# Altium schematic sheet 06- MCU PORTA_B.SchDoc: MCU2
size 420 x 297 mm; Revision: 1.0; SheetNumber: 6; SheetTotal: 13; Project: LOW LEVEL ECU
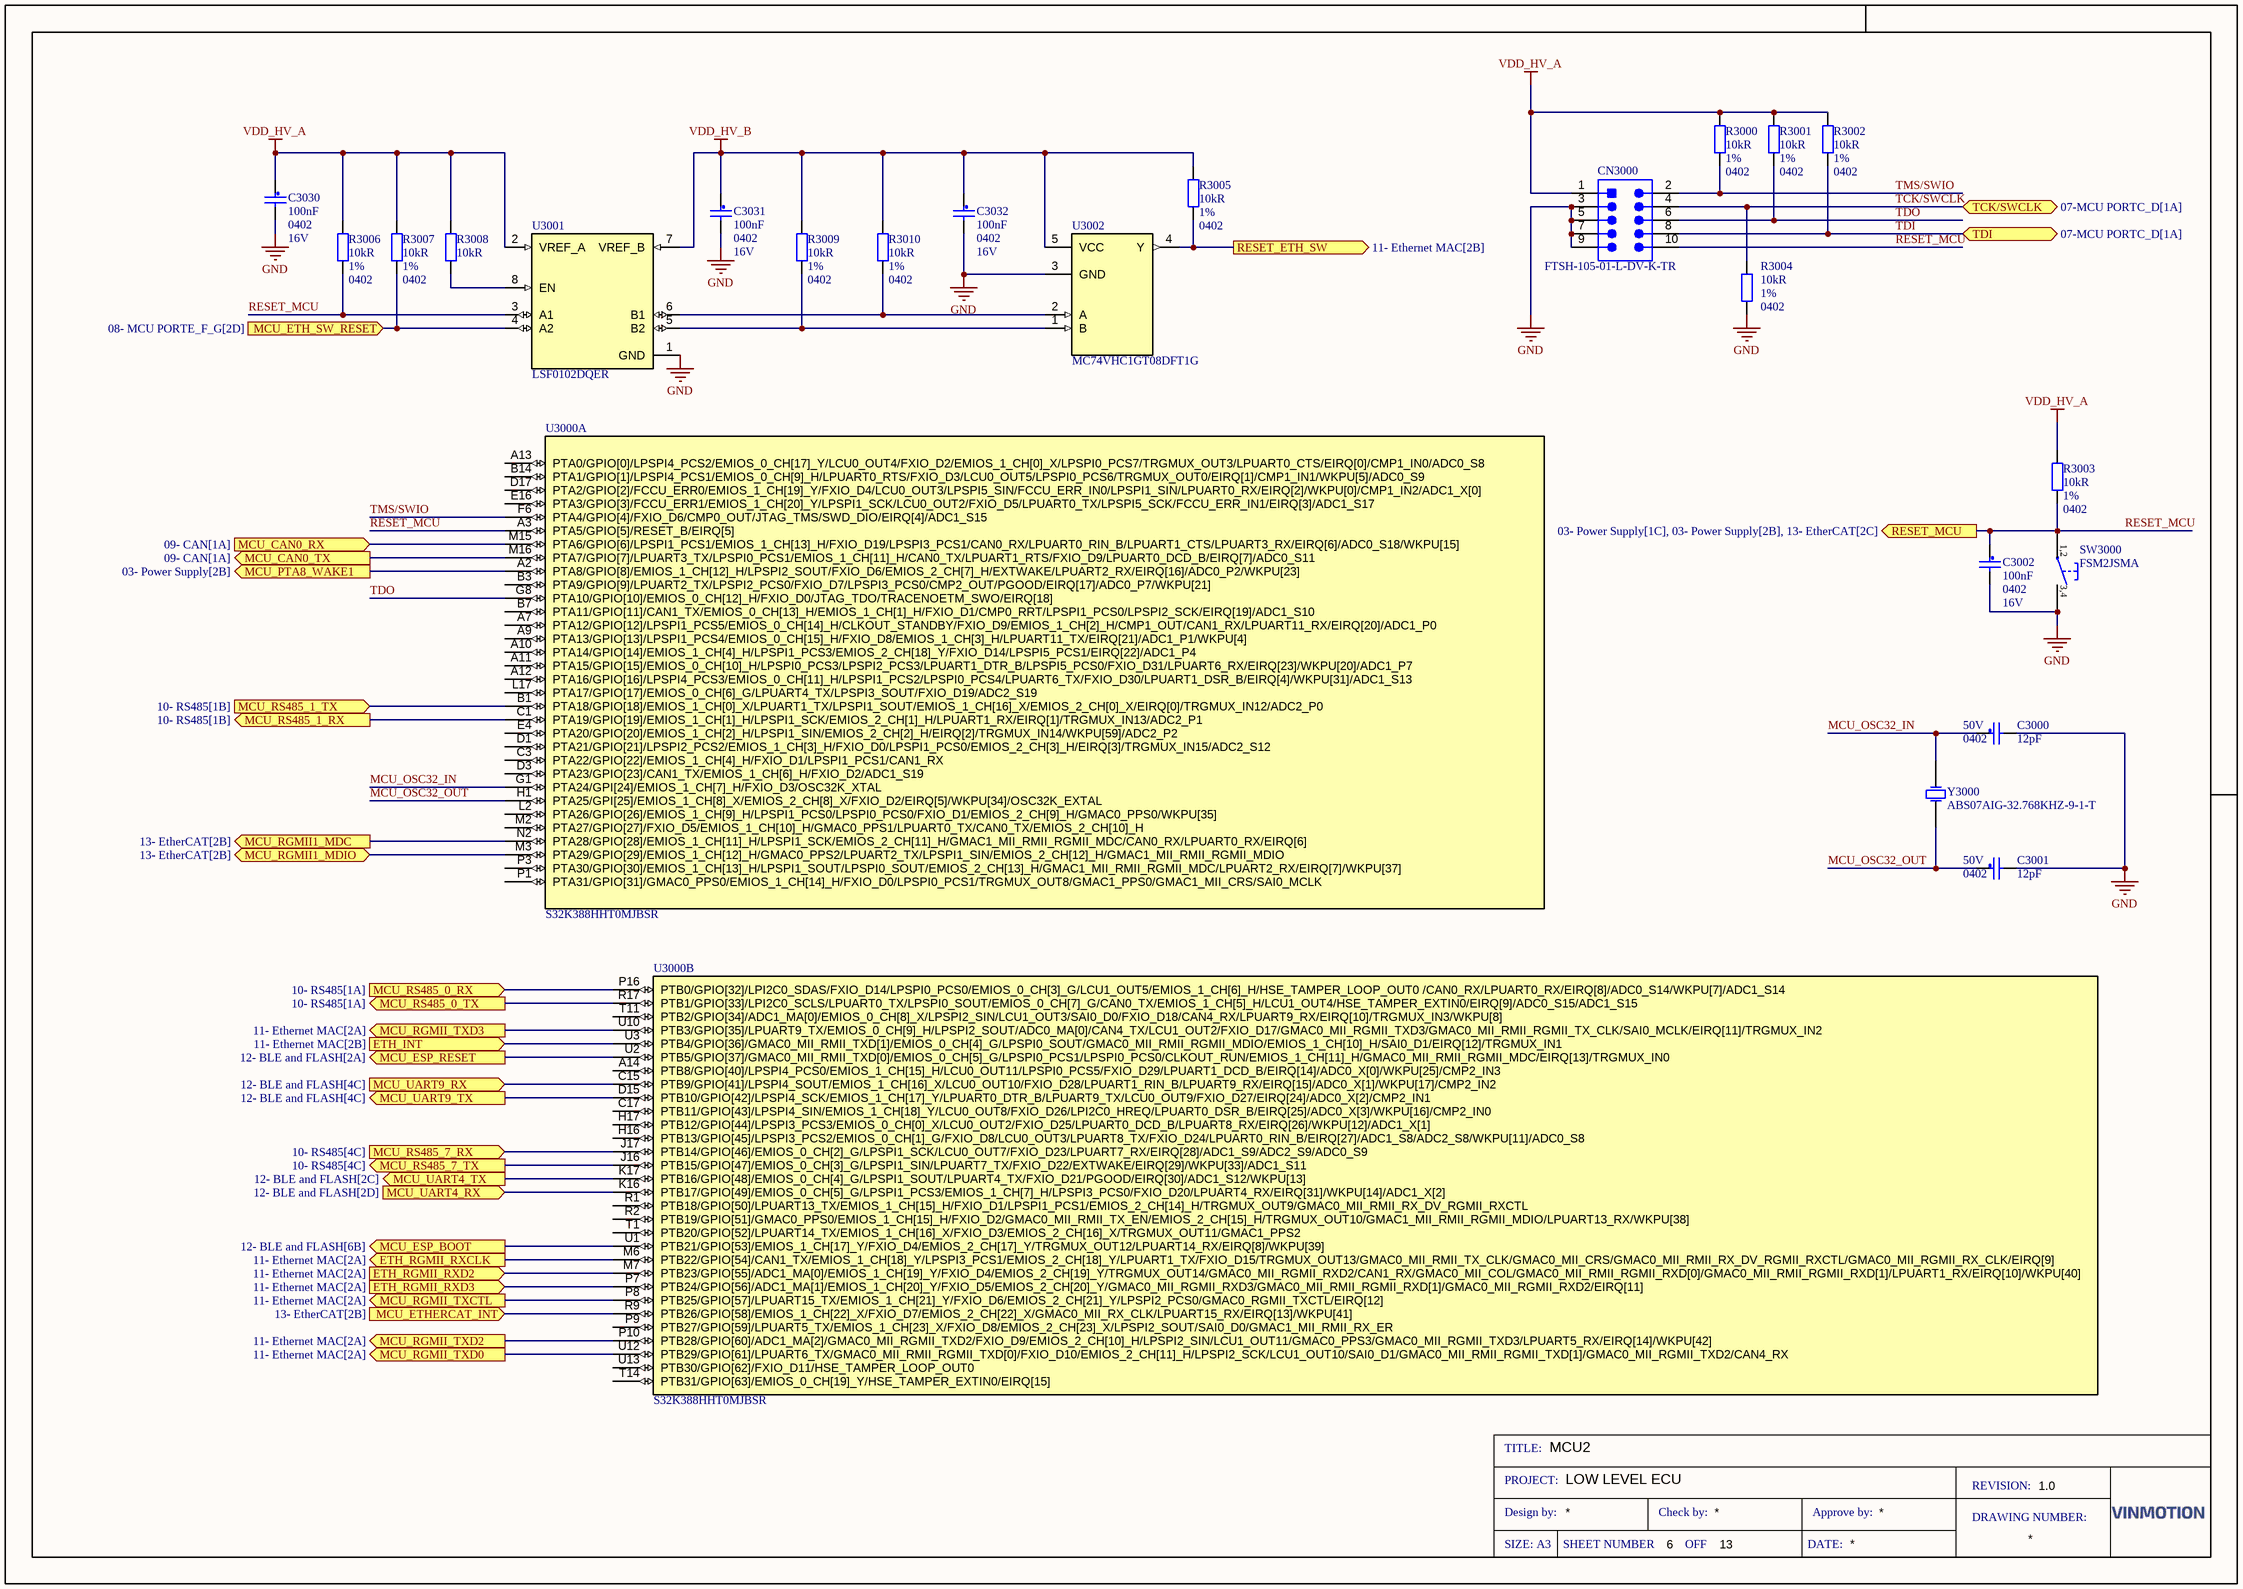
[diagram p0: 06- MCU PORTA_B.SchDoc]

## Parts
C3000  Voltage Rating: 50V  Case/Package: 0402  Capacitance: 12pF  [CAP0402]  (hidden comment: GCM1555C1H120JA16D)
C3001  Voltage Rating: 50V  Case/Package: 0402  Capacitance: 12pF  [CAP0402]  (hidden comment: GCM1555C1H120JA16D)
C3002  Capacitance: 100nF  Case/Package: 0402  Voltage Rating (DC): 16V  [CAP0402]  (hidden comment: 0402YC104KAT2A)
C3030  Capacitance: 100nF  Case/Package: 0402  Voltage Rating (DC): 16V  [CAP0402]  (hidden comment: 0402YC104KAT2A)
C3031  Capacitance: 100nF  Case/Package: 0402  Voltage Rating (DC): 16V  [CAP0402]  (hidden comment: 0402YC104KAT2A)
C3032  Capacitance: 100nF  Case/Package: 0402  Voltage Rating (DC): 16V  [CAP0402]  (hidden comment: 0402YC104KAT2A)
CN3000  FTSH-105-01-L-DV-K-TR  [SMTC-FTSH-105-01-L-DV-K_R]
R3000  value 10kR  Tolerance: 1%  Case/Package: 0402  [RES0402]  (hidden comment: RMCF0402FT10K0)
R3001  value 10kR  Tolerance: 1%  Case/Package: 0402  [RES0402]  (hidden comment: RMCF0402FT10K0)
R3002  value 10kR  Tolerance: 1%  Case/Package: 0402  [RES0402]  (hidden comment: RMCF0402FT10K0)
R3003  value 10kR  Tolerance: 1%  Case/Package: 0402  [RES0402]  (hidden comment: RMCF0402FT10K0)
R3004  value 10kR  Tolerance: 1%  Case/Package: 0402  [RES0402]  (hidden comment: RMCF0402FT10K0)
R3005  value 10kR  Tolerance: 1%  Case/Package: 0402  [RES0402]  (hidden comment: RMCF0402FT10K0)
R3006  value 10kR  Tolerance: 1%  Case/Package: 0402  [RES0402]  (hidden comment: RMCF0402FT10K0)
R3007  value 10kR  Tolerance: 1%  Case/Package: 0402  [RES0402]  (hidden comment: RMCF0402FT10K0)
R3008  value 10kR  [RES0402]  (hidden comment: RMCF0402FT10K0)
R3009  value 10kR  Tolerance: 1%  Case/Package: 0402  [RES0402]  (hidden comment: RMCF0402FT10K0)
R3010  value 10kR  Tolerance: 1%  Case/Package: 0402  [RES0402]  (hidden comment: RMCF0402FT10K0)
SW3000  FSM2JSMA  [TE_FSM2JSMASTR_R]
U3000  S32K388HHT0MJBSR  [BGA289C80P17X17_1400X1400X152]  (parts A,B of 9)
U3001  LSF0102DQER  [8-XFDFN]
U3002  MC74VHC1GT08DFT1G  [SOT95P280X145-5N]
Y3000  ABS07AIG-32.768KHZ-9-1-T  [CRYSTAL3215]

## Ports
ETH_INT (in, see 11- Ethernet MAC[2B]), ETH_RGMII_RXCLK (out, see 11- Ethernet MAC[2A]), ETH_RGMII_RXD2 (in, see 11- Ethernet MAC[2A]), ETH_RGMII_RXD3 (in, see 11- Ethernet MAC[2A]), MCU_CAN0_RX (in, see 09- CAN[1A]), MCU_CAN0_TX (out, see 09- CAN[1A]), MCU_ESP_BOOT (out, see 12- BLE and FLASH[6B]), MCU_ESP_RESET (out, see 12- BLE and FLASH[2A]), MCU_ETH_SW_RESET (in, see 08- MCU PORTE_F_G[2D]), MCU_ETHERCAT_INT (in, see 13- EtherCAT[2B]), MCU_PTA8_WAKE1 (out, see 03- Power Supply[2B]), MCU_RGMII1_MDC (out, see 13- EtherCAT[2B]), MCU_RGMII1_MDIO (bidir, see 13- EtherCAT[2B]), MCU_RGMII_TXCTL (out, see 11- Ethernet MAC[2A]), MCU_RGMII_TXD0 (out, see 11- Ethernet MAC[2A]), MCU_RGMII_TXD2 (out, see 11- Ethernet MAC[2A]), MCU_RGMII_TXD3 (out, see 11- Ethernet MAC[2A]), MCU_RS485_0_RX (in, see 10- RS485[1A]), MCU_RS485_0_TX (out, see 10- RS485[1A]), MCU_RS485_1_RX (out, see 10- RS485[1B]), MCU_RS485_1_TX (in, see 10- RS485[1B]), MCU_RS485_7_RX (in, see 10- RS485[4C]), MCU_RS485_7_TX (out, see 10- RS485[4C]), MCU_UART4_RX (in, see 12- BLE and FLASH[2D]), MCU_UART4_TX (out, see 12- BLE and FLASH[2C]), MCU_UART9_RX (in, see 12- BLE and FLASH[4C]), MCU_UART9_TX (out, see 12- BLE and FLASH[4C]), RESET_ETH_SW (out, see 11- Ethernet MAC[2B]), RESET_MCU (out, see 03- Power Supply[1C], 03- Power Supply[2B], 13- EtherCAT[2C]), TCK/SWCLK (bidir, see 07-MCU PORTC_D[1A]), TDI (bidir, see 07-MCU PORTC_D[1A])

## Nets
GND: C3000.2 C3001.2 C3002.2 C3030.2 C3031.2 C3032.2 CN3000.3 CN3000.5 CN3000.7 CN3000.9 R3004.1 SW3000.3 SW3000.4 U3001.1(GND) U3002.3(GND)
VDD_HV_A: C3030.1 CN3000.1 R3000.2 R3001.2 R3002.2 R3003.2 R3006.2 R3007.2 R3008.2 U3001.2(VREF_A)
VDD_HV_B: C3031.1 C3032.1 R3005.2 R3009.2 R3010.2 U3001.7(VREF_B) U3002.5(VCC)
ETH_INT: U3000.U3(PTB4/GPIO[36]/GMAC0_MII_RMII_TXD[1]/EMIOS_0_CH[4]_G/LPSPI0_SOUT/GMAC0_MII_RMII_RGMII_MDIO/EMIOS_1_CH[10]_H/SAI0_D1/EIRQ[12]/TRGMUX_IN1) ; port ETH_INT
ETH_RGMII_RXCLK: U3000.M6(PTB22/GPIO[54]/CAN1_TX/EMIOS_1_CH[18]_Y/LPSPI3_PCS1/EMIOS_2_CH[18]_Y/LPUART1_TX/FXIO_D15/TRGMUX_OUT13/GMAC0_MII_RMII_TX_CLK/GMAC0_MII_CRS/GMAC0_MII_RMII_RX_DV_RGMII_RXCTL/GMAC0_MII_RGMII_RX_CLK/EIRQ[9]) ; port ETH_RGMII_RXCLK
ETH_RGMII_RXD2: U3000.M7(PTB23/GPIO[55]/ADC1_MA[0]/EMIOS_1_CH[19]_Y/FXIO_D4/EMIOS_2_CH[19]_Y/TRGMUX_OUT14/GMAC0_MII_RGMII_RXD2/CAN1_RX/GMAC0_MII_COL/GMAC0_MII_RMII_RGMII_RXD[0]/GMAC0_MII_RMII_RGMII_RXD[1]/LPUART1_RX/EIRQ[10]/WKPU[40]) ; port ETH_RGMII_RXD2
ETH_RGMII_RXD3: U3000.P7(PTB24/GPIO[56]/ADC1_MA[1]/EMIOS_1_CH[20]_Y/FXIO_D5/EMIOS_2_CH[20]_Y/GMAC0_MII_RGMII_RXD3/GMAC0_MII_RMII_RGMII_RXD[1]/GMAC0_MII_RGMII_RXD2/EIRQ[11]) ; port ETH_RGMII_RXD3
MCU_CAN0_RX: U3000.M15(PTA6/GPIO[6]/LPSPI1_PCS1/EMIOS_1_CH[13]_H/FXIO_D19/LPSPI3_PCS1/CAN0_RX/LPUART0_RIN_B/LPUART1_CTS/LPUART3_RX/EIRQ[6]/ADC0_S18/WKPU[15]) ; port MCU_CAN0_RX
MCU_CAN0_TX: U3000.M16(PTA7/GPIO[7]/LPUART3_TX/LPSPI0_PCS1/EMIOS_1_CH[11]_H/CAN0_TX/LPUART1_RTS/FXIO_D9/LPUART0_DCD_B/EIRQ[7]/ADC0_S11) ; port MCU_CAN0_TX
MCU_ESP_BOOT: U3000.U1(PTB21/GPIO[53]/EMIOS_1_CH[17]_Y/FXIO_D4/EMIOS_2_CH[17]_Y/TRGMUX_OUT12/LPUART14_RX/EIRQ[8]/WKPU[39]) ; port MCU_ESP_BOOT
MCU_ESP_RESET: U3000.U2(PTB5/GPIO[37]/GMAC0_MII_RMII_TXD[0]/EMIOS_0_CH[5]_G/LPSPI0_PCS1/LPSPI0_PCS0/CLKOUT_RUN/EMIOS_1_CH[11]_H/GMAC0_MII_RMII_RGMII_MDC/EIRQ[13]/TRGMUX_IN0) ; port MCU_ESP_RESET
MCU_ETH_SW_RESET: R3007.1 U3001.4(A2) ; port MCU_ETH_SW_RESET
MCU_ETHERCAT_INT: U3000.R9(PTB26/GPIO[58]/EMIOS_1_CH[22]_X/FXIO_D7/EMIOS_2_CH[22]_X/GMAC0_MII_RX_CLK/LPUART15_RX/EIRQ[13]/WKPU[41]) ; port MCU_ETHERCAT_INT
MCU_OSC32_IN: C3000.1 U3000.G1(PTA24/GPI[24]/EMIOS_1_CH[7]_H/FXIO_D3/OSC32K_XTAL) Y3000.2(OSC2)
MCU_OSC32_OUT: C3001.1 U3000.H1(PTA25/GPI[25]/EMIOS_1_CH[8]_X/EMIOS_2_CH[8]_X/FXIO_D2/EIRQ[5]/WKPU[34]/OSC32K_EXTAL) Y3000.1(OSC1)
MCU_PTA8_WAKE1: U3000.A2(PTA8/GPIO[8]/EMIOS_1_CH[12]_H/LPSPI2_SOUT/FXIO_D6/EMIOS_2_CH[7]_H/EXTWAKE/LPUART2_RX/EIRQ[16]/ADC0_P2/WKPU[23]) ; port MCU_PTA8_WAKE1
MCU_RGMII1_MDC: U3000.N2(PTA28/GPIO[28]/EMIOS_1_CH[11]_H/LPSPI1_SCK/EMIOS_2_CH[11]_H/GMAC1_MII_RMII_RGMII_MDC/CAN0_RX/LPUART0_RX/EIRQ[6]) ; port MCU_RGMII1_MDC
MCU_RGMII1_MDIO: U3000.M3(PTA29/GPIO[29]/EMIOS_1_CH[12]_H/GMAC0_PPS2/LPUART2_TX/LPSPI1_SIN/EMIOS_2_CH[12]_H/GMAC1_MII_RMII_RGMII_MDIO) ; port MCU_RGMII1_MDIO
MCU_RGMII_TXCTL: U3000.P8(PTB25/GPIO[57]/LPUART15_TX/EMIOS_1_CH[21]_Y/FXIO_D6/EMIOS_2_CH[21]_Y/LPSPI2_PCS0/GMAC0_RGMII_TXCTL/EIRQ[12]) ; port MCU_RGMII_TXCTL
MCU_RGMII_TXD0: U3000.U12(PTB29/GPIO[61]/LPUART6_TX/GMAC0_MII_RMII_RGMII_TXD[0]/FXIO_D10/EMIOS_2_CH[11]_H/LPSPI2_SCK/LCU1_OUT10/SAI0_D1/GMAC0_MII_RMII_RGMII_TXD[1]/GMAC0_MII_RGMII_TXD2/CAN4_RX) ; port MCU_RGMII_TXD0
MCU_RGMII_TXD2: U3000.P10(PTB28/GPIO[60]/ADC1_MA[2]/GMAC0_MII_RGMII_TXD2/FXIO_D9/EMIOS_2_CH[10]_H/LPSPI2_SIN/LCU1_OUT11/GMAC0_PPS3/GMAC0_MII_RGMII_TXD3/LPUART5_RX/EIRQ[14]/WKPU[42]) ; port MCU_RGMII_TXD2
MCU_RGMII_TXD3: U3000.U10(PTB3/GPIO[35]/LPUART9_TX/EMIOS_0_CH[9]_H/LPSPI2_SOUT/ADC0_MA[0]/CAN4_TX/LCU1_OUT2/FXIO_D17/GMAC0_MII_RGMII_TXD3/GMAC0_MII_RMII_RGMII_TX_CLK/SAI0_MCLK/EIRQ[11]/TRGMUX_IN2) ; port MCU_RGMII_TXD3
MCU_RS485_0_RX: U3000.P16(PTB0/GPIO[32]/LPI2C0_SDAS/FXIO_D14/LPSPI0_PCS0/EMIOS_0_CH[3]_G/LCU1_OUT5/EMIOS_1_CH[6]_H/HSE_TAMPER_LOOP_OUT0_/CAN0_RX/LPUART0_RX/EIRQ[8]/ADC0_S14/WKPU[7]/ADC1_S14) ; port MCU_RS485_0_RX
MCU_RS485_0_TX: U3000.R17(PTB1/GPIO[33]/LPI2C0_SCLS/LPUART0_TX/LPSPI0_SOUT/EMIOS_0_CH[7]_G/CAN0_TX/EMIOS_1_CH[5]_H/LCU1_OUT4/HSE_TAMPER_EXTIN0/EIRQ[9]/ADC0_S15/ADC1_S15) ; port MCU_RS485_0_TX
MCU_RS485_1_RX: U3000.C1(PTA19/GPIO[19]/EMIOS_1_CH[1]_H/LPSPI1_SCK/EMIOS_2_CH[1]_H/LPUART1_RX/EIRQ[1]/TRGMUX_IN13/ADC2_P1) ; port MCU_RS485_1_RX
MCU_RS485_1_TX: U3000.B1(PTA18/GPIO[18]/EMIOS_1_CH[0]_X/LPUART1_TX/LPSPI1_SOUT/EMIOS_1_CH[16]_X/EMIOS_2_CH[0]_X/EIRQ[0]/TRGMUX_IN12/ADC2_P0) ; port MCU_RS485_1_TX
MCU_RS485_7_RX: U3000.J17(PTB14/GPIO[46]/EMIOS_0_CH[2]_G/LPSPI1_SCK/LCU0_OUT7/FXIO_D23/LPUART7_RX/EIRQ[28]/ADC1_S9/ADC2_S9/ADC0_S9) ; port MCU_RS485_7_RX
MCU_RS485_7_TX: U3000.J16(PTB15/GPIO[47]/EMIOS_0_CH[3]_G/LPSPI1_SIN/LPUART7_TX/FXIO_D22/EXTWAKE/EIRQ[29]/WKPU[33]/ADC1_S11) ; port MCU_RS485_7_TX
MCU_UART4_RX: U3000.K16(PTB17/GPIO[49]/EMIOS_0_CH[5]_G/LPSPI1_PCS3/EMIOS_1_CH[7]_H/LPSPI3_PCS0/FXIO_D20/LPUART4_RX/EIRQ[31]/WKPU[14]/ADC1_X[2]) ; port MCU_UART4_RX
MCU_UART4_TX: U3000.K17(PTB16/GPIO[48]/EMIOS_0_CH[4]_G/LPSPI1_SOUT/LPUART4_TX/FXIO_D21/PGOOD/EIRQ[30]/ADC1_S12/WKPU[13]) ; port MCU_UART4_TX
MCU_UART9_RX: U3000.C15(PTB9/GPIO[41]/LPSPI4_SOUT/EMIOS_1_CH[16]_X/LCU0_OUT10/FXIO_D28/LPUART1_RIN_B/LPUART9_RX/EIRQ[15]/ADC0_X[1]/WKPU[17]/CMP2_IN2) ; port MCU_UART9_RX
MCU_UART9_TX: U3000.D15(PTB10/GPIO[42]/LPSPI4_SCK/EMIOS_1_CH[17]_Y/LPUART0_DTR_B/LPUART9_TX/LCU0_OUT9/FXIO_D27/EIRQ[24]/ADC0_X[2]/CMP2_IN1) ; port MCU_UART9_TX
RESET_ETH_SW: R3005.1 U3002.4(Y) ; port RESET_ETH_SW
RESET_MCU: C3002.1 CN3000.10 R3003.1 R3006.1 SW3000.1 SW3000.2 U3000.A3(PTA5/GPIO[5]/RESET_B/EIRQ[5]) U3001.3(A1) ; port RESET_MCU
TCK/SWCLK: CN3000.4 R3004.2 ; port TCK/SWCLK
TDI: CN3000.8 R3002.1 ; port TDI
TDO: CN3000.6 R3001.1 U3000.G8(PTA10/GPIO[10]/EMIOS_0_CH[12]_H/FXIO_D0/JTAG_TDO/TRACENOETM_SWO/EIRQ[18])
TMS/SWIO: CN3000.2 R3000.1 U3000.F6(PTA4/GPIO[4]/FXIO_D6/CMP0_OUT/JTAG_TMS/SWD_DIO/EIRQ[4]/ADC1_S15)
NetR3008_1: R3008.1 U3001.8(EN)
NetR3009_1: R3009.1 U3001.5(B2) U3002.1(B)
NetR3010_1: R3010.1 U3001.6(B1) U3002.2(A)

Not connected (* = marked no-connect by the designer): U3000 A7(PTA12/GPIO[12]/LPSPI1_PCS5/EMIOS_0_CH[14]_H/CLKOUT_STANDBY/FXIO_D9/EMIOS_1_CH[2]_H/CMP1_OUT/CAN1_RX/LPUART11_RX/EIRQ[20]/ADC1_P0) A9(PTA13/GPIO[13]/LPSPI1_PCS4/EMIOS_0_CH[15]_H/FXIO_D8/EMIOS_1_CH[3]_H/LPUART11_TX/EIRQ[21]/ADC1_P1/WKPU[4]) A10(PTA14/GPIO[14]/EMIOS_1_CH[4]_H/LPSPI1_PCS3/EMIOS_2_CH[18]_Y/FXIO_D14/LPSPI5_PCS1/EIRQ[22]/ADC1_P4) A11(PTA15/GPIO[15]/EMIOS_0_CH[10]_H/LPSPI0_PCS3/LPSPI2_PCS3/LPUART1_DTR_B/LPSPI5_PCS0/FXIO_D31/LPUART6_RX/EIRQ[23]/WKPU[20]/ADC1_P7) A12(PTA16/GPIO[16]/LPSPI4_PCS3/EMIOS_0_CH[11]_H/LPSPI1_PCS2/LPSPI0_PCS4/LPUART6_TX/FXIO_D30/LPUART1_DSR_B/EIRQ[4]/WKPU[31]/ADC1_S13) A13(PTA0/GPIO[0]/LPSPI4_PCS2/EMIOS_0_CH[17]_Y/LCU0_OUT4/FXIO_D2/EMIOS_1_CH[0]_X/LPSPI0_PCS7/TRGMUX_OUT3/LPUART0_CTS/EIRQ[0]/CMP1_IN0/ADC0_S8) A14(PTB8/GPIO[40]/LPSPI4_PCS0/EMIOS_1_CH[15]_H/LCU0_OUT11/LPSPI0_PCS5/FXIO_D29/LPUART1_DCD_B/EIRQ[14]/ADC0_X[0]/WKPU[25]/CMP2_IN3) B3(PTA9/GPIO[9]/LPUART2_TX/LPSPI2_PCS0/FXIO_D7/LPSPI3_PCS0/CMP2_OUT/PGOOD/EIRQ[17]/ADC0_P7/WKPU[21]) B7(PTA11/GPIO[11]/CAN1_TX/EMIOS_0_CH[13]_H/EMIOS_1_CH[1]_H/FXIO_D1/CMP0_RRT/LPSPI1_PCS0/LPSPI2_SCK/EIRQ[19]/ADC1_S10) B14(PTA1/GPIO[1]/LPSPI4_PCS1/EMIOS_0_CH[9]_H/LPUART0_RTS/FXIO_D3/LCU0_OUT5/LPSPI0_PCS6/TRGMUX_OUT0/EIRQ[1]/CMP1_IN1/WKPU[5]/ADC0_S9) C3(PTA22/GPIO[22]/EMIOS_1_CH[4]_H/FXIO_D1/LPSPI1_PCS1/CAN1_RX) C17(PTB11/GPIO[43]/LPSPI4_SIN/EMIOS_1_CH[18]_Y/LCU0_OUT8/FXIO_D26/LPI2C0_HREQ/LPUART0_DSR_B/EIRQ[25]/ADC0_X[3]/WKPU[16]/CMP2_IN0) D1(PTA21/GPIO[21]/LPSPI2_PCS2/EMIOS_1_CH[3]_H/FXIO_D0/LPSPI1_PCS0/EMIOS_2_CH[3]_H/EIRQ[3]/TRGMUX_IN15/ADC2_S12) D3(PTA23/GPIO[23]/CAN1_TX/EMIOS_1_CH[6]_H/FXIO_D2/ADC1_S19) D17(PTA2/GPIO[2]/FCCU_ERR0/EMIOS_1_CH[19]_Y/FXIO_D4/LCU0_OUT3/LPSPI5_SIN/FCCU_ERR_IN0/LPSPI1_SIN/LPUART0_RX/EIRQ[2]/WKPU[0]/CMP1_IN2/ADC1_X[0]) E4(PTA20/GPIO[20]/EMIOS_1_CH[2]_H/LPSPI1_SIN/EMIOS_2_CH[2]_H/EIRQ[2]/TRGMUX_IN14/WKPU[59]/ADC2_P2) E16(PTA3/GPIO[3]/FCCU_ERR1/EMIOS_1_CH[20]_Y/LPSPI1_SCK/LCU0_OUT2/FXIO_D5/LPUART0_TX/LPSPI5_SCK/FCCU_ERR_IN1/EIRQ[3]/ADC1_S17) H16(PTB13/GPIO[45]/LPSPI3_PCS2/EMIOS_0_CH[1]_G/FXIO_D8/LCU0_OUT3/LPUART8_TX/FXIO_D24/LPUART0_RIN_B/EIRQ[27]/ADC1_S8/ADC2_S8/WKPU[11]/ADC0_S8) H17(PTB12/GPIO[44]/LPSPI3_PCS3/EMIOS_0_CH[0]_X/LCU0_OUT2/FXIO_D25/LPUART0_DCD_B/LPUART8_RX/EIRQ[26]/WKPU[12]/ADC1_X[1]) L2(PTA26/GPIO[26]/EMIOS_1_CH[9]_H/LPSPI1_PCS0/LPSPI0_PCS0/FXIO_D1/EMIOS_2_CH[9]_H/GMAC0_PPS0/WKPU[35]) L17(PTA17/GPIO[17]/EMIOS_0_CH[6]_G/LPUART4_TX/LPSPI3_SOUT/FXIO_D19/ADC2_S19) M2(PTA27/GPIO[27]/FXIO_D5/EMIOS_1_CH[10]_H/GMAC0_PPS1/LPUART0_TX/CAN0_TX/EMIOS_2_CH[10]_H) P1(PTA31/GPIO[31]/GMAC0_PPS0/EMIOS_1_CH[14]_H/FXIO_D0/LPSPI0_PCS1/TRGMUX_OUT8/GMAC1_PPS0/GMAC1_MII_CRS/SAI0_MCLK) P3(PTA30/GPIO[30]/EMIOS_1_CH[13]_H/LPSPI1_SOUT/LPSPI0_SOUT/EMIOS_2_CH[13]_H/GMAC1_MII_RMII_RGMII_MDC/LPUART2_RX/EIRQ[7]/WKPU[37]) P9(PTB27/GPIO[59]/LPUART5_TX/EMIOS_1_CH[23]_X/FXIO_D8/EMIOS_2_CH[23]_X/LPSPI2_SOUT/SAI0_D0/GMAC1_MII_RMII_RX_ER) R1(PTB18/GPIO[50]/LPUART13_TX/EMIOS_1_CH[15]_H/FXIO_D1/LPSPI1_PCS1/EMIOS_2_CH[14]_H/TRGMUX_OUT9/GMAC0_MII_RMII_RX_DV_RGMII_RXCTL) R2(PTB19/GPIO[51]/GMAC0_PPS0/EMIOS_1_CH[15]_H/FXIO_D2/GMAC0_MII_RMII_TX_EN/EMIOS_2_CH[15]_H/TRGMUX_OUT10/GMAC1_MII_RMII_RGMII_MDIO/LPUART13_RX/WKPU[38]) T1(PTB20/GPIO[52]/LPUART14_TX/EMIOS_1_CH[16]_X/FXIO_D3/EMIOS_2_CH[16]_X/TRGMUX_OUT11/GMAC1_PPS2) T11(PTB2/GPIO[34]/ADC1_MA[0]/EMIOS_0_CH[8]_X/LPSPI2_SIN/LCU1_OUT3/SAI0_D0/FXIO_D18/CAN4_RX/LPUART9_RX/EIRQ[10]/TRGMUX_IN3/WKPU[8]) T14(PTB31/GPIO[63]/EMIOS_0_CH[19]_Y/HSE_TAMPER_EXTIN0/EIRQ[15]) U13(PTB30/GPIO[62]/FXIO_D11/HSE_TAMPER_LOOP_OUT0)

## Notes on the sheet
- TITLE:
- PROJECT:
- Design by:
- Check by:
- Approve by:
- DRAWING NUMBER:
- REVISION:
- SIZE: A3
- SHEET NUMBER
- OFF
- DATE:
- (in symbol CMP-ROOT-0128-12) 1,2; 3,4

## Library data of the parts
C3000 C3001 = CMP-00203-1: CAP CER 12PF 50V C0G/NP0 0402; Manufacturer 1: Murata Electronics; Dielectric: C0G; Crossable(YES/NO): YES; Mount Type(SMD/TH): SMD; Tolerance: 5%; Mount: Surface Mount; Lead Free: Lead Free; Weight: 0.000212oz; Ratings: AEC-Q200; Termination: SMD/SMT; Packaging: Tape and Reel; Max Operating Temperature: 125°C; Case Code (Imperial): 0402; Height: 0.5mm; Voltage Rating (DC): 50V; Manufacturer Part Number 1: GCM1555C1H120JA16D; Thickness: 0.022inch; Width: 0.02inch; Case Code (Metric): 1005; Min Operating Temperature: -55°C; Length: 0.039inch; Package Quantity: 10000
C3002 C3030-C3032 = CMP-00988-1: CAP CER 0.1UF 16V X7R 0402; Manufacturer 1: KYOCERA AVX; Crossable(YES/NO): YES; Mount Type(SMD/TH): SMD; Case Code (Imperial): 0402; Case Code (Metric): 1005; Dielectric: X7R; Manufacturer Part Number 1: 0402YC104KAT2A; Max Operating Temperature: 125°C; Min Operating Temperature: -55°C; Mount: Surface Mount; Voltage Rating: 16V
CN3000 = CMP-ROOT-0060-2: CONN HEADER SMD 10POS 1.27MM; Manufacturer 1: Samtec Inc.; Current Rating: 1.75A; Number of Positions: 10; Connector Type: Male Pin; Crossable(YES/NO): NO; Row Spacing: 0.05inch; Gender: Male; Termination: Solder; Color: Black; Contact Mating Length: 0.12inch; Housing Color: Black; Max Current Rating: 1.75A; Housing Material: Polymer; Mount Type(SMD/TH): SMD; Orientation: Straight; Lead Free: Lead Free; Radiation Hardening: No; Contact Plating: Gold; Contact Material: Bronze; Max Operating Temperature: 125°C; Min Operating Temperature: -55°C; Packaging: Tape and Reel; Mount: Surface Mount; Depth: 3.43mm; Package Quantity: 550; REACH SVHC: No SVHC; Number of Rows: 2; Pitch: 1.27mm; Number of Contacts: 10; Length: 6.35mm; Supplier 1: Digi-Key; Manufacturer Part Number 1: FTSH-105-01-L-DV-K-TR; Stock 1: 11254; Pricing 1: 1=3.60000, 10=3.45800, 100=2.88200 (USD); RoHS: Yes; ComponentLink1URL: https://datasheet.ciiva.com/10245/ftsh-mt-10245289.pdf?src-supplier=Avnet; ComponentLink1Description: https://datasheet.ciiva.com/10245/ftsh-mt-10245289.pdf?src-supplier=Avnet; ComponentLink2URL: https://datasheet.ciiva.com/739/ftsh-1xx-xx-xxx-dv-xxx-mkt-739005.pdf?src-supplier=Digi-Key; ComponentLink2Description: https://datasheet.ciiva.com/739/ftsh-1xx-xx-xxx-dv-xxx-mkt-739005.pdf?src-supplier=Digi-Key; ComponentLink3URL: https://datasheet.ciiva.com/23735/81359-23735917.pdf?src-supplier=Newark; ComponentLink3Description: https://datasheet.ciiva.com/23735/81359-23735917.pdf?src-supplier=Newark; Supplier Part Number 1: SAM13165CT-ND
R3000-R3010 = CMP-01105-1: RES 10K OHM 1% 1/16W 0402; Manufacturer: Stackpole Electronics; Package Length: 1mm; Package Height: 0.3mm; Package Width: 0.5mm; Power: 63mW; Rated Temperature: 70°C; Reference Standard: AEC-Q200; Temperature Coefficient (ppm/Cel): 100; Working Voltage: 50V; Category: Chip SMD Resistors; Construction: Rectangular; JESD-609 Code: e3; Manufacturer Part Number: RMCF0402FT10K0; Max Operating Temperature: 155°C; Min Operating Temperature: -55°C; Mounting Technology: Surface Mount; Pins: 2; Package Shape: Rectangular; Packaging: Tape and Reel; Reach SVHC Compliant: Yes; Resistor Type: FIXED RESISTOR; RoHS Compliant: Yes; Technology: METAL GLAZE/THICK FILM; Terminal Finish: Nickel; Termination: Wraparound
  R3008: Tolerance: 1%; Case/Package: 0402
SW3000 = CMP-ROOT-0128-12: SWITCH TACTILE SPST-NO 0.05A 24V; Manufacturer 1: TE Connectivity; Throw Configuration: SPST; Contact Current Rating: 50mA; Crossable(YES/NO): NO; Max Voltage Rating (DC): 12V; Actuator Material: Polyamide; Switch Function: Off-Mom; Mount Type(SMD/TH): SMD; Operating Force: 1.57N; Actuator Length: 0.7mm; Switch Travel: 0.25mm; Contact Resistance: 100mR; Illumination Type: Non-Illuminated,Illuminated; Actuator Type: Standard; Mechanical Life: 100000Cycles; Contact Material: Copper Alloy; Max Operating Temperature: 85°C; Orientation: Straight; Mount: Surface Mount; Type: Switch; Package Quantity: 750; Min Operating Temperature: -35°C; Manufacturer Part Number 1: FSM2JSMA; Packaging: Loose Piece; Voltage Rating: 24V; Width: 6mm; Voltage Rating (DC): 24V; Termination: Gull Wing; Case/Package: SMA (6mm x 10mm); Contact Plating: Silver; Length: 6mm; Electrical Life: 100000Cycles; Current Rating: 50mA; REACH SVHC: Unknown
U3000 = CMP-01150-1: ARM® Cortex®-M7F S32K3 Microcontroller IC 32-Bit 5-Core 320MHz 8MB (8M x 8) FLASH 289-LFBGA (14x14); Manufacturer: NXP Semiconductors; Category: Microcontrollers; Manufacturer Part Number: S32K388HHT0MJBSR
U3001 = CMP-01193-1: IC VOLTAGE LEVEL BIDIR 8-X2SON; Manufacturer: Texas Instruments; Manufacturer Lifecycle Status: ACTIVE; Channel Type: Bidirectional; Data Rate: 200Mbps; High Level Output Current: 64mA; Logic Function: Translator; Max Junction Temperature (Tj): 150°C; Max Supply Voltage: 5.5V; Min Supply Voltage: 950mV; Number of Bits: 1; Propagation Delay: 1.3ns; Turn-On Delay Time: 1.5ns; Min Operating Temperature: -40°C; Ambient Temperature Range High: 125°C; Category: Voltage Level Shifters; Height: 400µm; Lead Free: Lead Free; Length: 1.4mm; Lifecycle Status: Production; Low Level Output Current: 64mA; Manufacturer Part Number: LSF0102DQER; Max Operating Temperature: 125°C; Mounting Technology: Surface Mount; Number of Circuits: 1; Number of Inputs: 1; Number of Outputs: 1; Pins: 8; Packaging: Digi-Reel®; Radiation Hardening: No; RoHS: Compliant; Schedule B: 8542390000, 8542390000|8542390000|8542390000|8542390000|8542390000; Thickness: 370µm; Width: 1mm
U3002 = CMP-01194-1: IC GATE AND 1CH 2-INP SC88A; Manufacturer: onsemi; Manufacturer Lifecycle Status: ACTIVE; Number of Outputs: 1; Max Supply Voltage: 5.5V; Min Supply Voltage: 3V; Number of Inputs: 2; Operating Supply Voltage: 3.3V; Propagation Delay: 16.5ns; Category: Logic Gates; China RoHS: Compliant; Height - Seated (Max): 1.1mm; Length: 2mm; Lifecycle Status: Production; Manufacturer Part Number: MC74VHC1GT08DFT1G; Max Operating Temperature: 125°C; Min Operating Temperature: -55°C; Number of Channels: 1; Number of Circuits: 1; Number of Terminals: 5; REACH SVHC: Yes; RoHS: Compliant; Terminal Pitch: 650µm; Width: 1.25mm
Y3000 = CMP-00382-1: CRYSTAL 32.768KHZ 9PF SMD; Manufacturer 1: Abracon LLC; ESR (Equivalent Series Resistance): 70kR; Frequency Tolerance: 10ppm; Crossable(YES/NO): NO; Width: 0.059inch; Ratings: AEC-Q200; Min Operating Temperature: -40°C; Manufacturer Part Number 1: ABS07AIG-32.768KHZ-9-1-T; Number of Pins: 2; Mount Type(SMD/TH): SMD; Length: 0.126inch; Mount: Surface Mount; Height: 0.035inch; Packaging: Tape and Reel; Frequency: 32.768kHz; Case/Package: SMD/SMT; Load Capacitance: 9pF; Max Operating Temperature: 125°C